# Altium schematic sheet I2C_PowerMonitor_INA226.SchDoc
size A4; DocumentNumber: 10; SheetNumber: 10; SheetTotal: 16
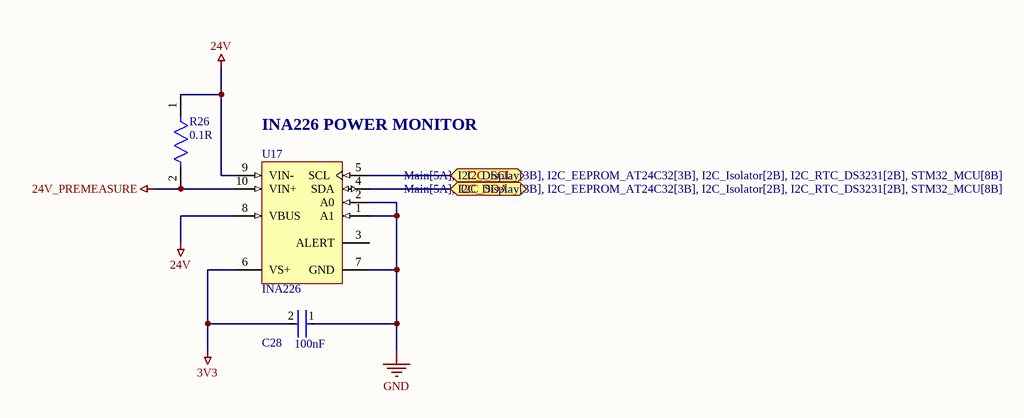
[diagram p0: I2C_PowerMonitor_INA226.SchDoc]

## Parts
C28  100nF  [FP-CGA3E-0_3-0_1-IPC_A]
R26  0.1R  [FP-RMCF2512-IPC_B]
U17  INA226  [DGS0010A_L]

## Ports
I2C_SCL (bidir, see Main[5A], I2C_Display[3B], I2C_EEPROM_AT24C32[3B], I2C_Isolator[2B], I2C_RTC_DS3231[2B], STM32_MCU[8B]), I2C_SDA (bidir, see Main[5A], I2C_Display[3B], I2C_EEPROM_AT24C32[3B], I2C_Isolator[2B], I2C_RTC_DS3231[2B], STM32_MCU[8B])

## Nets
3V3: C28.2 U17.6(VS+)
24V: R26.1 U17.8(VBUS) U17.9(VIN-)
24V_PREMEASURE: R26.2 U17.10(VIN+)
GND: C28.1 U17.1(A1) U17.2(A0) U17.7(GND)
I2C_SCL: U17.5(SCL) ; port I2C_SCL
I2C_SDA: U17.4(SDA) ; port I2C_SDA

Not connected (* = marked no-connect by the designer): U17 3(ALERT)

## Notes on the sheet
- (near U17) INA226 POWER MONITOR

## Library data of the parts
C28 = CMP-2000-07546-2: Cap Ceramic 100nF 50V X7R 10% Pad SMD 0603 +125°C Automotive T/R; Weight: 7.1E-05oz; Composition: Ceramic; Max Operating Temperature: 125°C; Termination: SMD/SMT; Dielectric: X7R; Length: 1.6mm; Package Quantity: 1; REACH SVHC: No SVHC; Lead Free: Lead Free; Case Code (Metric): 1608; Min Operating Temperature: -55°C; Packaging: Tape and Reel; Tolerance: 10%; Voltage Rating: 50V; Case Code (Imperial): 0603; Capacitance: 100nF; Case/Package: 0603; Voltage Rating (DC): 50V; Depth: 0.8mm; Radiation Hardening: No; Ratings: AEC-Q200; Mount: Surface Mount; Voltage: 50V; Thickness: 0.035inch; Width: 0.8mm; Height: 0.8mm
R26 = CMP-26527-001289-1: 0.1Ω ±5% 1W 2512 Thick Film Chip Resistor AEC-Q200 compliant; Temperature Coefficient: 200ppm/°C; Resistance: 100mR; Tolerance: 5%; Contact Plating: Tin; Series: RMCF; Case Code (Metric): 6432; Max Power Dissipation: 1W; RoHS Compliant: Yes; Construction: Rectangular; Case/Package: 2512; Power Rating: 1W; Resistor Type: Thick Film; Length: 0.248inch; Features: Automotive AEC-Q200; Mount: Surface Mount; Size Code: 2512; Height: 0.028inch; Max Operating Temperature: 155°C; Number of Terminations: 2; Packaging: Tape and Reel; Min Operating Temperature: -55°C; Military Standard: Not; Depth: 3.2mm; Case Code (Imperial): 2512; Lead Free: Lead Free; Radiation Hardening: No; Width: 0.126inch
U17 = CMP-0704-00058-2: High-Side Measurement, Bi-Directional Current / Power Monitor with I2C Interface, 2.7 to 5.5 V, -40 to 125 degC, 10-pin SOP (DGS10), Green (RoHS & no Sb/Br); PartNumber: INA226AIDGSR; Vs(Max)(V): 5.5; CMRR(Min)(dB): 126; Rating: Catalog; Input Offset (+/-)(Max)(uV): 10; Small-Signal Bandwidth(Typ)(MHz): 0.007; Input Offset Drift (+/-)(Max)(uV/Degrees Celsius): 0.1; Common Mode Range(Max)(V): 36; Gain(V/V): 1; SubFamily: Current Shunt Monitor; Quiescent Current (+/-)(Typ)(mA): 0.33; Vs(Min)(V): 2.7; Common Mode Range(Min)(V): 0; ComponentLink2URL: http://www.ti.com/general/docs/lit/getliterature.tsp?genericPartNumber=INA226&fileType=pdf; ComponentLink1URL: http://www.ti.com/; Mounting Technology: Surface Mount; PackageDescription: 10-Pin Plastic Small Outline, Body 3 x 3 mm, Pitch 0.5 mm; ComponentLink3Description: Package Specification; Code_JEDEC: MO-153; Eco-Plan: Green (RoHS & no Sb/Br); PackageReference: DGS0010A; ComponentLink2Description: Datasheet; ComponentLink3URL: http://www.ti.com/lit/ml/mpds035b/mpds035b.pdf; ComponentLink1Description: Manufacturer URL; DatasheetVersion: SBOS547; PackageVersion: 4073272/C, 02/2004